# EAGLE design totalizer2020 (EAGLE 9.5.2)
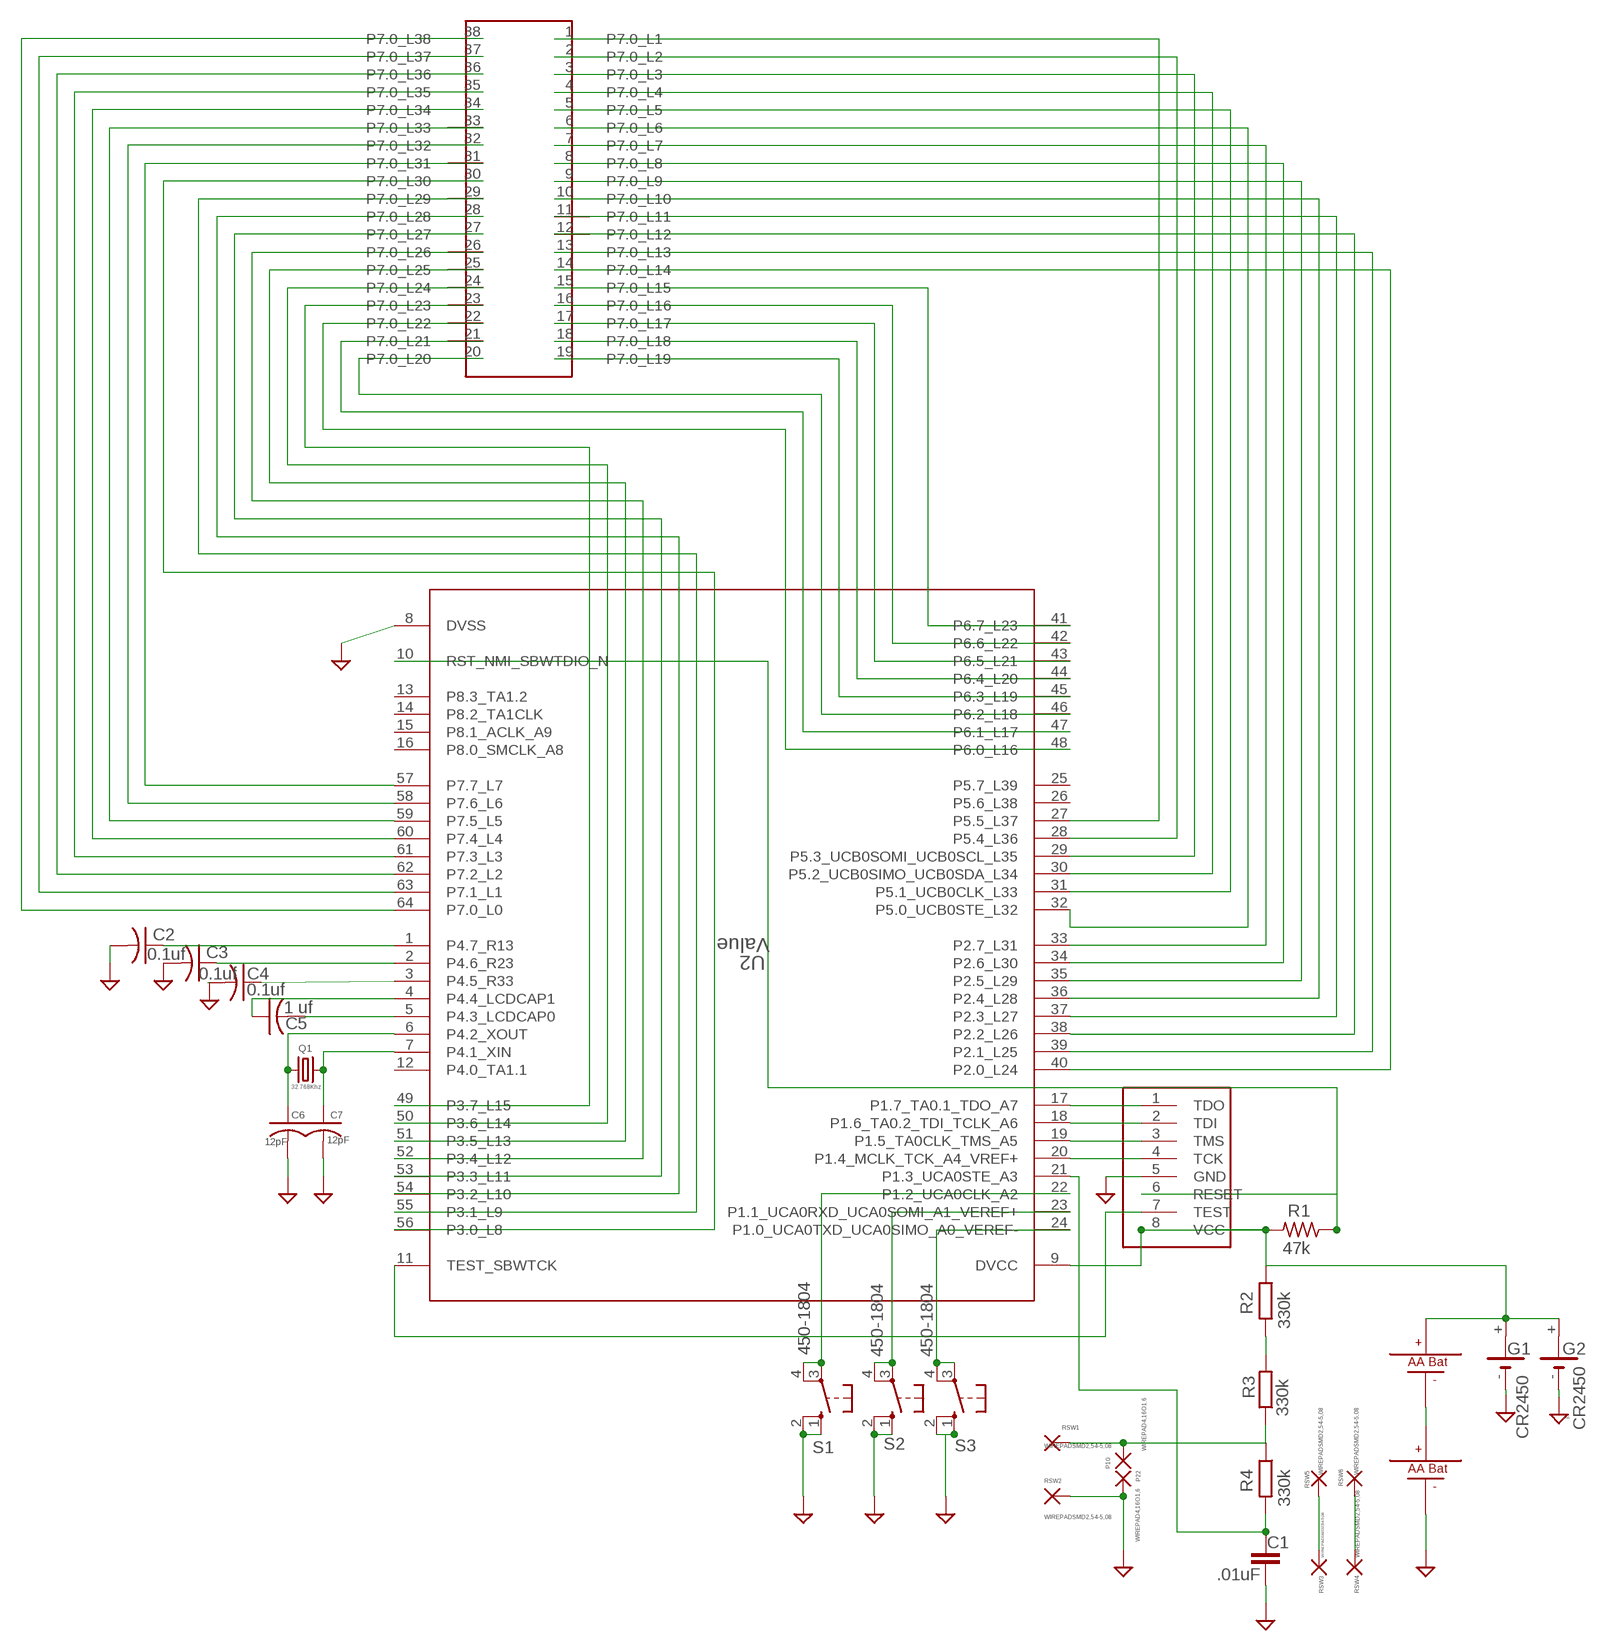
[diagram p0: schematic, sheet 1]

## Parts
8PINCONNECTOR  JST-8JST-8  [HDRVR8W64P150_1X8_1200X350X500B]
C1  .01uF  C-EUC0805  [C0805]
C2  0.1uf  C-USC0805  [C0805]
C3  0.1uf  C-USC0805  [C0805]
C4  0.1uf  C-USC0805  [C0805]
C5  1 uf  C-USC0805  [C0805]
C6  12pF  C-USC0805  [C0805]
C7  12pF  C-USC0805  [C0805]
G1  CR2450  CR2430H  [CR2430H]
G2  CR2450  CR2430H  [CR2430H]
P10  WIREPAD4,16O1,6  [4,16O1,6]
P22  WIREPAD4,16O1,6  [4,16O1,6]
Q1  32.768Khz  KX-327-NHT  [3.2X1.5]
R1  47k  R-US_R0805  [R0805]
R2  330k  R-R0805  [R0805]
R3  330k  R-R0805  [R0805]
R4  330k  R-R0805  [R0805]
RSW1  WIREPADSMD2,54-5,08  [SMD2,54-5,08]
RSW2  WIREPADSMD2,54-5,08  [SMD2,54-5,08]
RSW3  WIREPADSMD2,54-5,08  [SMD2,54-5,08]
RSW4  WIREPADSMD2,54-5,08  [SMD2,54-5,08]
RSW5  WIREPADSMD2,54-5,08  [SMD2,54-5,08]
RSW6  WIREPADSMD2,54-5,08  [SMD2,54-5,08]
S1  450-1804  10-XX  [B3F-10XX]
S2  450-1804  10-XX  [B3F-10XX]
S3  450-1804  10-XX  [B3F-10XX]
U2  Value  MSP430FR4133IPMR  [PM0064A_N]
U$1  LCD-38LCD-38  [DIP7140W53P200L5505H450Q38B]
U$2  AA_BATTERY  [AA_BATTERY]
U$3  AA_BATTERY  [AA_BATTERY]

## Nets
GND: 8PINCONNECTOR.5(GND) C1.1 C2.2 C3.2 C4.2 C6.2 C7.2 G1.- G2.- P22.1(P) RSW2.1(P) S1.1(S) S1.2(S1) S2.1(S) S2.2(S1) S3.1(S) S3.2(S1) U2.8(DVSS) U$3.3(BAT_-) U$3.4(BAT_-)
N$1: 8PINCONNECTOR.1(TDO) U2.17(P1.7_TA0.1_TDO_A7)
N$2: 8PINCONNECTOR.2(TDI) U2.18(P1.6_TA0.2_TDI_TCLK_A6)
N$3: 8PINCONNECTOR.3(TMS) U2.19(P1.5_TA0CLK_TMS_A5)
N$4: 8PINCONNECTOR.4(TCK) U2.20(P1.4_MCLK_TCK_A4_VREF+)
N$5: C6.1 Q1.1 U2.6(P4.2_XOUT)
N$6: 8PINCONNECTOR.6(RESET) R1.1 U2.10(RST_NMI_SBWTDIO_N)
N$7: 8PINCONNECTOR.7(TEST) U2.11(TEST_SBWTCK)
N$8: RSW3.1(P) RSW5.1(P)
N$9: S2.3(P) S2.4(P1) U2.23(P1.1_UCA0RXD_UCA0SOMI_A1_VEREF+)
N$10: S1.3(P) S1.4(P1) U2.22(P1.2_UCA0CLK_A2)
N$11: C5.1 U2.4(P4.4_LCDCAP1)
N$12: S3.3(P) S3.4(P1) U2.24(P1.0_UCA0TXD_UCA0SIMO_A0_VEREF-)
N$13: C5.2 U2.5(P4.3_LCDCAP0)
N$14: C4.1 U2.3(P4.5_R33)
N$15: C3.1 U2.2(P4.6_R23)
N$16: C2.1 U2.1(P4.7_R13)
N$17: 8PINCONNECTOR.8(VCC) G1.+ G2.+ R1.2 R2.1 U2.9(DVCC) U$2.2(BAT_+) U$2.P1(BAT_+)
N$18: C1.2 R4.2 U2.21(P1.3_UCA0STE_A3)
N$19: C7.1 Q1.2 U2.7(P4.1_XIN)
N$20: U2.64(P7.0_L0) U$1.38(P7.0_L38)
N$21: U2.63(P7.1_L1) U$1.37(P7.0_L37)
N$22: U2.62(P7.2_L2) U$1.36(P7.0_L36)
N$23: U2.61(P7.3_L3) U$1.35(P7.0_L35)
N$24: U2.60(P7.4_L4) U$1.34(P7.0_L34)
N$25: U2.59(P7.5_L5) U$1.33(P7.0_L33)
N$26: U2.58(P7.6_L6) U$1.32(P7.0_L32)
N$27: U2.57(P7.7_L7) U$1.31(P7.0_L31)
N$28: U2.56(P3.0_L8) U$1.30(P7.0_L30)
N$29: U2.55(P3.1_L9) U$1.29(P7.0_L29)
N$30: U2.54(P3.2_L10) U$1.28(P7.0_L28)
N$31: U2.53(P3.3_L11) U$1.27(P7.0_L27)
N$32: U2.52(P3.4_L12) U$1.26(P7.0_L26)
N$33: U2.51(P3.5_L13) U$1.25(P7.0_L25)
N$34: U2.50(P3.6_L14) U$1.24(P7.0_L24)
N$35: U2.49(P3.7_L15) U$1.23(P7.0_L23)
N$36: U2.48(P6.0_L16) U$1.22(P7.0_L22)
N$37: U2.47(P6.1_L17) U$1.21(P7.0_L21)
N$38: U2.46(P6.2_L18) U$1.20(P7.0_L20)
N$39: U2.45(P6.3_L19) U$1.19(P7.0_L19)
N$40: U2.44(P6.4_L20) U$1.18(P7.0_L18)
N$41: U$2.3(BAT_-) U$2.4(BAT_-) U$3.2(BAT_+) U$3.P1(BAT_+)
N$42: U2.43(P6.5_L21) U$1.17(P7.0_L17)
N$43: U2.42(P6.6_L22) U$1.16(P7.0_L16)
N$44: U2.41(P6.7_L23) U$1.15(P7.0_L15)
N$45: U2.40(P2.0_L24) U$1.14(P7.0_L14)
N$46: U2.39(P2.1_L25) U$1.13(P7.0_L13)
N$47: U2.38(P2.2_L26) U$1.12(P7.0_L12)
N$48: U2.37(P2.3_L27) U$1.11(P7.0_L11)
N$49: U2.36(P2.4_L28) U$1.10(P7.0_L10)
N$50: U2.35(P2.5_L29) U$1.9(P7.0_L9)
N$51: U2.34(P2.6_L30) U$1.8(P7.0_L8)
N$52: U2.33(P2.7_L31) U$1.7(P7.0_L7)
N$53: U2.32(P5.0_UCB0STE_L32) U$1.6(P7.0_L6)
N$54: U2.31(P5.1_UCB0CLK_L33) U$1.5(P7.0_L5)
N$55: U2.30(P5.2_UCB0SIMO_UCB0SDA_L34) U$1.4(P7.0_L4)
N$56: U2.29(P5.3_UCB0SOMI_UCB0SCL_L35) U$1.3(P7.0_L3)
N$57: U2.28(P5.4_L36) U$1.2(P7.0_L2)
N$58: U2.27(P5.5_L37) U$1.1(P7.0_L1)
N$59: RSW4.1(P) RSW6.1(P)
N$69: R2.2 R3.2
N$70: P10.1(P) R3.1 R4.1 RSW1.1(P)
Unconnected: G1.+@1(+) G2.+@1(+) U2.12(P4.0_TA1.1) U2.13(P8.3_TA1.2) U2.14(P8.2_TA1CLK) U2.15(P8.1_ACLK_A9) U2.16(P8.0_SMCLK_A8) U2.25(P5.7_L39) U2.26(P5.6_L38)

## Library data of the parts
8PINCONNECTOR = JST-8:JST-8
C1 = rcl:C-EU: CAPACITOR, European symbol; SPICEPREFIX: C
C2-C5 = rcl:C-US: CAPACITOR, American symbol; SPICEPREFIX: C
C6 C7 = resistor:C-US: CAPACITOR, American symbol
G1 G2 = battery:CR2430H: LI BATTERY Varta
P10 P22 RSW1-RSW6 = wirepad:WIREPAD: Wire PAD connect wire on PCB
Q1 = crystal-geyer_V1_0:KX-327: Tuning Fork Crystals (kHz) SMD: KX327 - Serie Model Size l/w/h [mm] Frequency Range Frequency Stability Temp. Range [°C] Load Capacitance AECQ 200 availabel Datasheet KX-327VT KX-327FT KX-327RT KX-327NHT KX-327NHF KX-327L KX-327S 1.25/1.05/0.5 1.6/1.0/0.5 2.0/1.2/0.6 3.2/1.5/0.8 3.2/1.5/0.8 7.0/1.5/1.4 8.2/3.8/2.5 32,768 kHz 32,768 kHz 32,768 kHz 32,768 kHz 32,768 kHz 32,768 kHz 32,768 kHz ±10 … ±20ppm ±10 … ±20ppm ±10 … ±20ppm ±10 … ±20ppm ±10 … ±20ppm ±10 … ±20ppm ±5 … ±20ppm (*) -40°C …+85°C (*) -40°C …+85°C (*) -40°C …+85°C (*) -40°C …+85°C (*) -40°C …+125°C (*) -40°C …+85°C (*) -40°C …+85°C 7/9/12,5 7/9/12,5 7/9/12,6 7/9/12,5 9/12,5 7/9/12,5 6/12,5 - - - - yes - - KX-327VT.pdf <http://www.geyer-electronic.de/uploads/tx_userartikelfrequenz/GEYER-KX-327VT.pdf> KX-327FT.pdf <http://www.geyer-electronic.de/uploads/tx_userartikelfrequenz/GEYER-KX-327FT.pdf> KX-327RT.pdf <http://www.geyer-electronic.de/uploads/tx_userartikelfrequenz/GEYER-KX-327RT.pdf> KX-327NHT.pdf <http://www.geyer-electronic.de/uploads/tx_userartikelfrequenz/GEYER-KX-327NHT.pdf> KX-327NHF.pdf <http://www.geyer-electronic.de/uploads/tx_userartikelfrequenz/GEYER-KX-327NHF.pdf> KX-327L.pdf <http://www.geyer-electronic.de/uploads/tx_userartikelfrequenz/GEYER-KX-327L.pdf> KX-327S.pdf <http://www.geyer-electronic.de/uploads/tx_userartikelfrequenz/GEYER-KX-327S.pdf> <http://www.geyer-electronic.de/fileadmin/template/img/logo-geyer-electronic.png> Details see: http://www.geyer-electronic.de/Frequenz-Produkte.9.0.html Created 2016-06-07, Hans Locher 2016 (C) Geyer Quartz Technology KX327VT,KX327FT,KX327RT,KX327NHT,KX327NHF,KX327S,KX327L;125105;1610;2012;3215;7015;8238;1,25x1,05,1.25x1.05;1,6x1,0,1.6x1.0;2,0x1,2,2.0x1.2;3,2x1,5,3.2x1.5;8,2x3,8,8.2x3.8,7.0x1.5,7,0x1,532.768kHz
R1 = resistor:R-US_: RESISTOR, American symbol
R2-R4 = quantum-sensor:R: Resistor
S1-S3 = switch-omron:10-XX: OMRON SWITCH; MPN: B3F-1000; OC_FARNELL: 176432; OC_NEWARK: 36M3542
U2 = msp430fr4133-64:MSP430FR4133IPMR; ALTERNATEPARTNUMBER: MSP430FR4133IPM; APPLICATION_BUILDNUMBER: *; COMPTYPE: IC; MANUFACTURER: Texas Instruments; MOUNTTYPE: SMT; PACKAGEREFERENCE: PM0064A; PARTNUMBER: MSP430FR4133IPMR; PIN_COUNT: 64; REFDES: RefDes; ROHS: Y; TYPE: TYPE
U$1 = LCD-38:LCD-38
U$2 U$3 = AA_Battery:AA_BATTERY

## Board
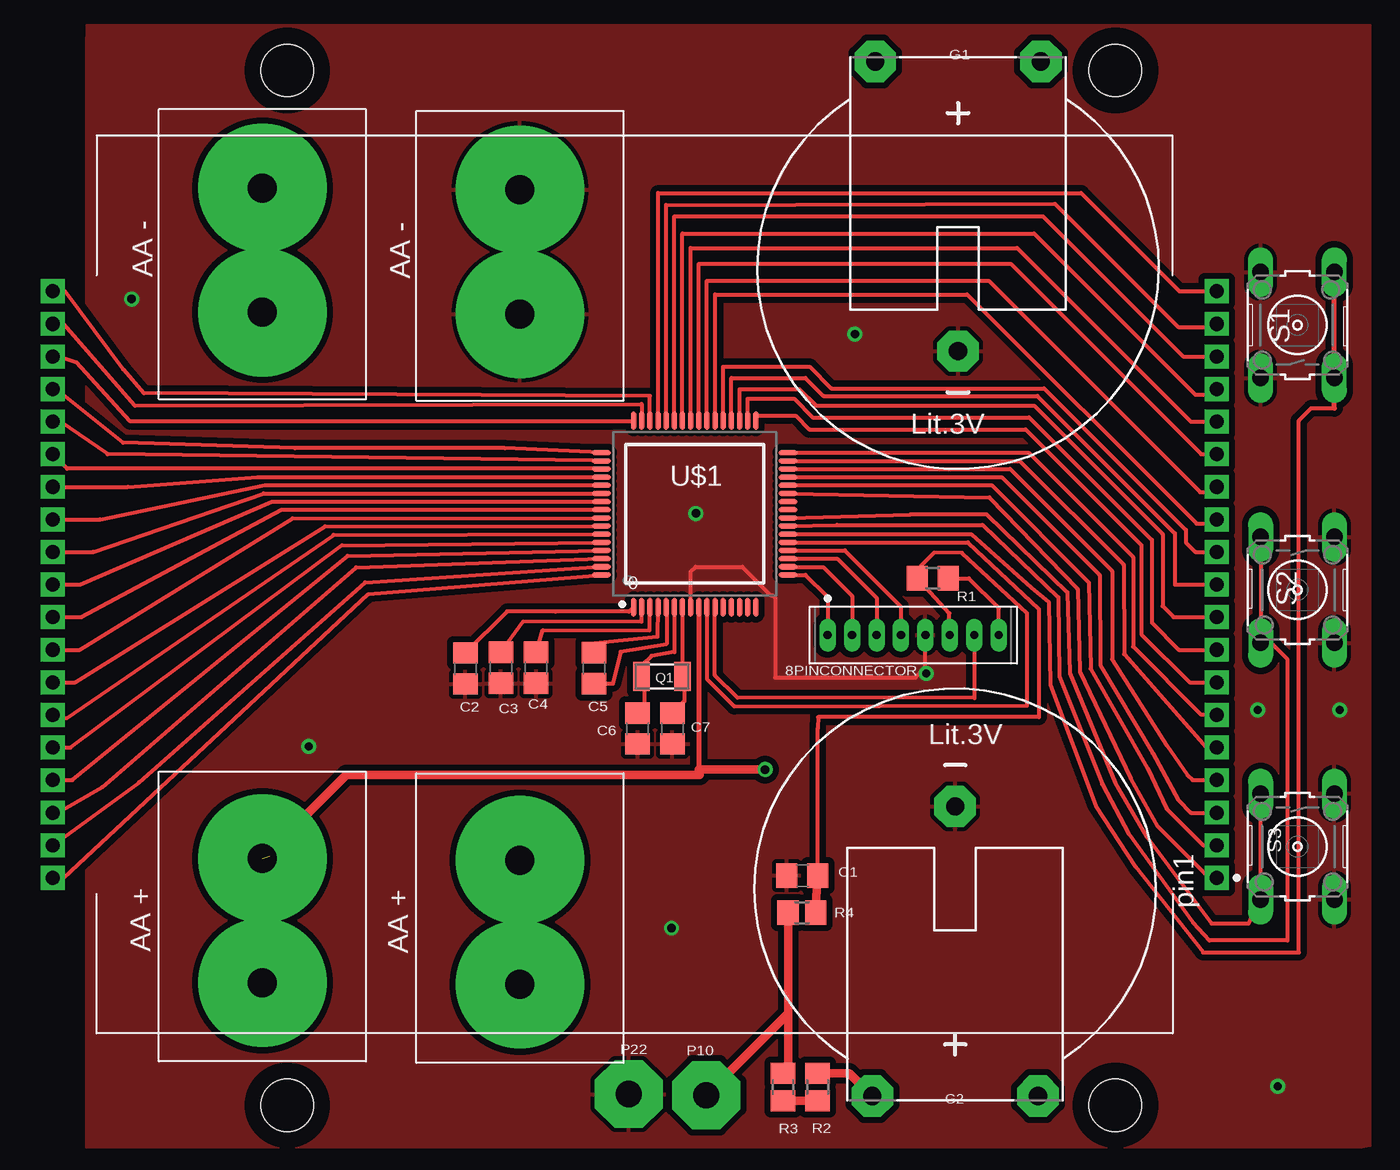
[diagram p1: board, top side]
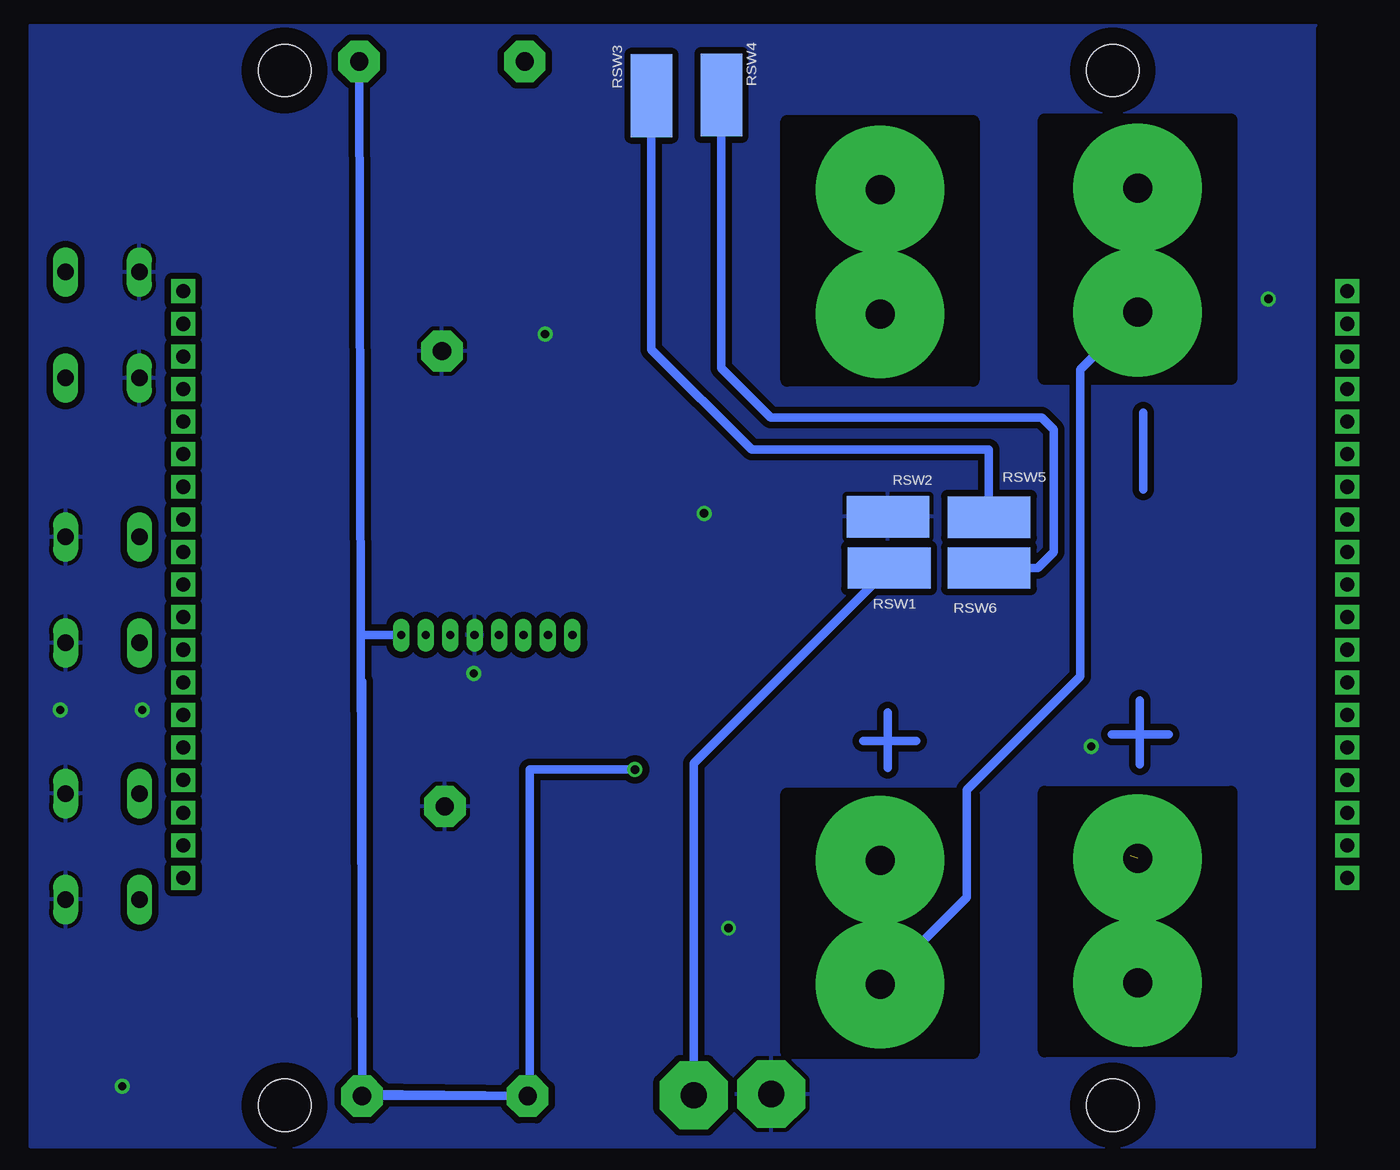
[diagram p2: board, bottom side, seen from below]

No outline drawn. Coordinates in mm, seen from the top.
Copper layers (1*16): Top 0.035mm / dielectric 1.5mm / Bottom 0.035mm
Design rules "default": minimum track width 10mil, minimum drill 20mil, track to track 8mil, track to pad 8mil, pad to pad 8mil, via to via 8mil, smd to smd 8mil, copper to edge 40mil, drill to drill 8mil, minimum pad ring 10mil, minimum via ring 8mil, stop-mask expansion 4mil, vias tented up to drill 0mil, thermal gap 10mil
Holes 3.2 mm at 16.76,3.05 16.76,66.55 67.56,66.55 67.56,3.05

### Footprints (pad centres in the part's own frame; a part is rotated, then mirrored left to right if it is on the bottom)
HDRVR8W64P150_1X8_1200X350X500B = drill 0.508 pad 1.016 long: 1 0,0; 2 1.5,0; 3 3,0; 4 4.5,0; 5 6,0; 6 7.5,0; 7 9,0; 8 10.5,0
C0805 = smd 1.3 x 1.5: 1 -0.95,0; 2 0.95,0
CR2430H = drill 1.118 pad 2.54 octagon: + 5.08,12.7; +@1 -5.08,12.7; - 0,-5.08
4,16O1,6 = drill 1.6 pad 4.166 octagon: 1 0,0
3.2X1.5 = smd 1 x 1.8: 1 -1.25,0; 2 1.25,0
R0805 = smd 1.3 x 1.5: 1 -0.95,0; 2 0.95,0
R0805' = smd 1.3 x 1.5: 1 -0.85,0; 2 0.85,0
SMD2,54-5,08 = smd 2.54 x 5.08: 1 0,0
B3F-10XX = drill 1.016 long: 1 -3.251,2.261; 2 3.251,2.261; 3 -3.251,-2.261; 4 3.251,-2.261
PM0064A_N = smd 1.15 x 0.3: 1 -5.725,3.75; 2 -5.725,3.25; 3 -5.725,2.75; 4 -5.725,2.25; 5 -5.725,1.75; 6 -5.725,1.25; 7 -5.725,0.75; 8 -5.725,0.25; 9 -5.725,-0.25; 10 -5.725,-0.75; 11 -5.725,-1.25; 12 -5.725,-1.75; 13 -5.725,-2.25; 14 -5.725,-2.75; 15 -5.725,-3.25; 16 -5.725,-3.75; 33 5.725,-3.75; 34 5.725,-3.25; 35 5.725,-2.75; 36 5.725,-2.25; 37 5.725,-1.75; 38 5.725,-1.25; 39 5.725,-0.75; 40 5.725,-0.25; 41 5.725,0.25; 42 5.725,0.75; 43 5.725,1.25; 44 5.725,1.75; 45 5.725,2.25; 46 5.725,2.75; 47 5.725,3.25; 48 5.725,3.75 | smd 0.3 x 1.15: 17 -3.75,-5.725; 18 -3.25,-5.725; 19 -2.75,-5.725; 20 -2.25,-5.725; 21 -1.75,-5.725; 22 -1.25,-5.725; 23 -0.75,-5.725; 24 -0.25,-5.725; 25 0.25,-5.725; 26 0.75,-5.725; 27 1.25,-5.725; 28 1.75,-5.725; 29 2.25,-5.725; 30 2.75,-5.725; 31 3.25,-5.725; 32 3.75,-5.725; 49 3.75,5.725; 50 3.25,5.725; 51 2.75,5.725; 52 2.25,5.725; 53 1.75,5.725; 54 1.25,5.725; 55 0.75,5.725; 56 0.25,5.725; 57 -0.25,5.725; 58 -0.75,5.725; 59 -1.25,5.725; 60 -1.75,5.725; 61 -2.25,5.725; 62 -2.75,5.725; 63 -3.25,5.725; 64 -3.75,5.725
DIP7140W53P200L5505H450Q38B = drill 0.864 pad 1.464 square: 1 -35.7,18; 2 -35.7,16; 3 -35.7,14; 4 -35.7,12; 5 -35.7,10; 6 -35.7,8; 7 -35.7,6; 8 -35.7,4; 9 -35.7,2; 10 -35.7,0; 11 -35.7,-2; 12 -35.7,-4; 13 -35.7,-6; 14 -35.7,-8; 15 -35.7,-10; 16 -35.7,-12; 17 -35.7,-14; 18 -35.7,-16; 19 -35.7,-18; 20 35.7,-18; 21 35.7,-16; 22 35.7,-14; 23 35.7,-12; 24 35.7,-10; 25 35.7,-8; 26 35.7,-6; 27 35.7,-4; 28 35.7,-2; 29 35.7,0; 30 35.7,2; 31 35.7,4; 32 35.7,6; 33 35.7,8; 34 35.7,10; 35 35.7,12; 36 35.7,14; 37 35.7,16; 38 35.7,18
AA_BATTERY = drill 1.778 pad 7.874: 2 -16.764,0; 3 16.764,0; 4 24.384,0; P1 -24.384,0

### Placement (x,y rotation side)
8PINCONNECTOR  49.91,31.9 0 top
C1  48.36,17.14 0 top
C2  27.69,29.84 270 top
C3  29.87,29.9 270 top
C4  32.03,29.9 270 top
C5  35.59,29.87 270 top
C6  38.25,26.16 270 top
C7  40.39,26.16 270 top
G1  57.91,54.41 0 top
G2  57.73,16.31 180 top
P10  42.47,3.66 0 top
P22  37.72,3.73 0 top
Q1  39.75,29.36 0 top
R1  56.36,35.38 0 top
R2  330k  [R0805']  49.3,4.17 270 top
R3  330k  [R0805']  47.17,4.17 270 top
R4  330k  [R0805']  48.34,14.86 0 top
RSW1  30.48,36.02 270 bottom
RSW2  30.56,39.17 270 bottom
RSW3  45.06,65 0 bottom
RSW4  40.77,65.05 0 bottom
RSW5  24.36,39.14 270 bottom
RSW6  24.36,36.02 90 bottom
S1  78.74,50.93 90 top
S2  78.74,34.67 270 top
S3  78.74,18.92 270 top
U2  41.76,39.34 90 top
U$1  38.07,35 180 top
U$2  15.24,34.95 90 top
U$3  31.04,34.85 90 top

### Tracks (layer width: path | path; a pad name or v marks a point on that pad's centre or on a via)
GND  (via drill 0.51)
  Top 0.254: U2.8 41.51,35.79 41.81,36.09 44.68,36.09 46.43,34.34 46.53,34.34 46.69,34.19 46.69,29.29 55.3,29.29 55.91,29.9 8PINCONNECTOR.5
  Bottom 0.254: 31.19,39.8 RSW2.1
  other vias: 41.83,39.37 51.59,50.37 77.52,4.22 40.34,13.92 7.21,52.53 18.08,25.07 55.96,29.54 76.3,27.3 81.33,27.3
  pour Bottom (isolate 0.406): 4.37,69.24 4.37,0.48 83.13,0.48 83.19,0.5 83.19,69.32 83.16,69.34 5.23,69.34 4.29,69.32 4.32,69.27
  pour Top (isolate 0.381): 4.48,69.33 83.19,69.33 83.19,0.55 82.66,0.46 4.45,0.46 4.45,67.89
N$1
  Top 0.254: U2.17 48.55,35.59 49.91,34.23 8PINCONNECTOR.1
N$2
  Top 0.254: U2.18 47.5,36.08 49.63,36.08 51.41,34.29 8PINCONNECTOR.2
N$3
  Top 0.254: U2.19 50.5,36.59 52.91,34.19 8PINCONNECTOR.3
N$4
  Top 0.254: U2.20 50.97,37.09 54.41,33.65 8PINCONNECTOR.4
N$5
  Top 0.254: C6.1 38.66,27.52 38.66,29.2 Q1.1 38.5,30.02 39.11,30.63 40.51,30.86 U2.6
N$6
  Top 0.254: U2.10 42.51,29.22 44.2,27.53 62.13,27.57 62.13,33.25 58.14,36.94 56.44,36.96 55.41,35.93 R1.1 55.59,35.2 57.39,33.24 8PINCONNECTOR.6
N$7
  Top 0.254: 8PINCONNECTOR.7 58.91,28.04 44.38,28.07 43,29.44 U2.11
N$8
  Bottom 0.508: RSW5.1 24.36,43.28 38.91,43.28 45.06,49.43 RSW3.1
N$9
  Top 0.254: U2.23 50.48,38.66 59.36,38.65 59.44,38.66 64.06,34.22 64.14,29.36 66.75,22.76 68.4,19.68 72.33,14.26 73.33,13.16 78.13,13.16 78.13,30.4 77.11,31.42 S2.4 76.52,31.46 76.48,31.87 S2.3
N$10
  Top 0.254: 81,45.82 79.58,45.82 78.82,45.06 78.82,12.42 72.95,12.42 68.79,17.7 66.36,21.43 63.58,28.84 63.48,33.93 62.4,34.83 58.72,38.09 U2.22
  Top 0.305: 81,45.82 S1.3 S1.4
N$11
  Top 0.254: C5.1 35.59,31.38 39.47,31.79 39.48,33.59 U2.4
N$12
  Top 0.254: S3.3 S3.4 75.74,14.2 73.46,14.2 69.5,19.51 67.56,22.84 64.77,29.57 64.62,34.52 59.66,39.31 55,39.31 U2.24
N$13
  Top 0.254: C5.2 36.74,28.92 37.22,30.89 40.03,31.36 40.03,33.59 U2.5
N$14
  Top 0.254: C4.1 32.45,32.21 38.99,32.2 38.99,33.6 U2.3
N$15
  Top 0.254: C3.1 31.23,32.72 38.51,32.72 U2.2
N$16
  Top 0.254: C2.1 30.25,33.35 33.19,33.36 33.21,33.34 37.73,33.34 U2.1
N$17  (via drill 0.51)  (1 unrouted)
  Top 0.254: R1.2 58.58,35.38 60.41,33.55 8PINCONNECTOR.8
  Top 0.305: U2.9 42.01,23.65 42.01,23.37
  Top 0.508: 15.7,17.55 15.7,18.36 | G2.+ 51.24,5.02 R2.1 | 42.01,23.37 42.06,23.32 20.37,23.32 U$2.2 | v46.08,23.65 42.01,23.65
  Bottom 0.254: 52.68,3.63 G2.+
  Bottom 0.305: G2.+ 52.53,3.73 | 62.84,31.9 62.89,31.85
  Bottom 0.508: 62.81,29.06 62.81,3.63 52.68,3.63 62.81,3.76 62.89,31.85 G1.+ | 52.53,3.73 52.53,23.65 v46.08,23.65 | 8PINCONNECTOR.8 62.84,31.9 | U$2.2 U$2.P1 | U$2.P1 15.24,10.21 15.39,10.06 15.39,10.41 U$2.P1
  other vias: 15.24,10.57
N$18
  Top 0.254: U2.21 58.52,37.59 62.87,33.5 62.87,26.87 49.33,26.86 49.31,26.2 C1.2 | 49.19,15.37 R4.2
  Top 0.508: C1.2 49.19,15.37
N$19
  Top 0.254: U2.7 Q1.2 41.12,29.24 41.12,27.85 C7.1
N$20
  Top 0.254: U$1.38 3.06,17 21.74,34.41 U2.64
N$21
  Top 0.254: U$1.37 7.67,22.86 21.54,35.13 U2.63
N$22
  Top 0.254: U$1.36 3.03,21.18 5.41,22.55 20.99,36.06 U2.62
N$23
  Top 0.254: U$1.35 3.59,23 20.47,36.76 U2.61
N$24
  Top 0.254: U$1.34 3.48,25 20.11,37.41 U2.60
N$25
  Top 0.254: U$1.33 2.58,26.8 3.2,26.8 19.61,38.05 U2.59
N$26
  Top 0.254: U$1.32 3.76,29 19.09,38.57 U2.58
N$27
  Top 0.254: U$1.31 4.04,31 17.09,39.07 U2.57
N$28
  Top 0.254: U$1.30 4.14,33 16.41,39.59 U2.56
N$29
  Top 0.254: U$1.29 4.06,35 15.84,40.09 U2.55
N$30
  Top 0.254: U$1.28 4.85,37 15.31,40.59 U2.54
N$31
  Top 0.254: U$1.27 5.28,39 15.39,41.09 U2.53
N$32
  Top 0.254: U$1.26 6.98,41 14.95,41.59 U2.52
N$33
  Top 0.254: U2.51 36.02,42.11 3.26,42.11 U$1.25
N$34
  Top 0.254: U2.50 35.52,42.59 35.52,42.6 5.75,43.01 2.84,45 U$1.24
N$35
  Top 0.254: U2.49 30.11,43.37 17.25,43.37 6.68,43.7 2.57,47 U$1.23
N$36
  Top 0.254: U$1.22 2.8,49 3.83,48.64 7.13,45.02 37.96,45.02 U2.48
N$37
  Top 0.254: U$1.21 3.05,51 7.41,45.98 38.5,46.08 U2.47
N$38
  Top 0.254: U$1.20 3.15,53 6.7,48.21 7.97,46.75 39.01,46.57 U2.46
N$39
  Top 0.254: U2.45 39.51,59.03 65.46,59.03 71.49,53 U$1.19
N$40
  Top 0.254: U2.44 40.01,58.3 63.83,58.38 71.46,50.77 73.55,50.77 U$1.18
N$41
  Bottom 0.508: U$2.3 18.75,48.21 18.75,29.36 25.7,22.4 25.7,15.8 U$3.P1 U$3.2 | U$2.4 U$2.3 | U$2.3 15.49,51.46
N$42
  Top 0.254: U2.43 40.51,57.61 63.12,57.61 71.72,49 U$1.17
N$43
  Top 0.254: U2.42 41.01,56.54 62.59,56.54 72.47,46.66 73.43,46.66 U$1.16
N$44
  Top 0.254: U2.41 41.51,55.65 61.54,55.65 72.19,45 U$1.15
N$45
  Top 0.254: U2.40 42.01,54.69 61.14,54.69 72.82,43 U$1.14
N$46
  Top 0.254: U2.39 42.51,53.65 59.79,53.65 72.77,40.66 73.44,40.66 U$1.13
N$47
  Top 0.254: U2.38 43.01,52.81 58.47,52.81 72.54,38.73 73.51,38.73 U$1.12
N$48
  Top 0.254: U2.37 43.51,48.37 48.81,48.37 50.14,47.04 63.2,47.04 71.88,38.35 71.88,37.59 72.47,37 U$1.11
N$49
  Top 0.254: U2.36 44.01,47.68 48.55,47.68 49.65,46.58 62.78,46.58 71.22,38.14 71.22,35 U$1.10
N$50
  Top 0.254: U2.35 44.51,46.99 48.18,46.99 49.2,45.97 62.59,45.97 70.46,38.1 70.46,33.68 71.14,33 U$1.9
N$51
  Top 0.254: U2.34 45.01,46.41 47.85,46.41 49,45.26 62.28,45.26 69.8,37.74 69.8,32.66 71.46,31 U$1.8
N$52
  Top 0.254: U2.33 45.51,45.36 47.95,45.36 48.79,44.53 62.05,44.53 69.16,37.41 69.16,31.95 72.12,29 U$1.7
N$53
  Top 0.254: U2.32 62.24,43.09 68.66,36.68 68.66,31.19 72.85,27 U$1.6
N$54
  Top 0.254: U$1.5 73.51,24.74 73.38,24.74 68.1,30.73 68.07,36.22 61.7,42.59 U2.31
N$55
  Top 0.254: U$1.4 72.3,23 71.98,23.32 70.71,25.13 67.36,30.41 67.37,35.83 61.11,42.09 U2.30
N$56
  Top 0.254: U2.29 60.59,41.59 66.6,35.59 66.65,30.07 69.85,24.66 71.42,21.78 72.2,21 U$1.3
N$57
  Top 0.254: U$1.2 72.96,19 70.71,21.25 69.55,23.72 66.04,29.84 65.94,35.13 59.97,41.09 U2.28
N$58
  Top 0.254: U$1.1 73.32,17 70.16,20.17 68.5,23.11 65.38,29.67 65.25,34.72 59.84,40.35 U2.27
N$59
  Bottom 0.508: RSW6.1 21.36,36.02 20.37,37.01 20.37,44.53 21.11,45.26 37.74,45.26 40.77,48.28 RSW4.1
N$60
  Bottom 0.508: 13.34,25.81 16.84,25.81
N$61
  Bottom 0.508: 14.88,45.54 14.88,40.84
N$62
  Bottom 0.508: 15.11,27.89 15.11,23.95
N$63
  Bottom 0.508: 28.83,25.4 32.05,25.4
N$64
  Bottom 0.508: 30.56,27.15 30.56,23.75
N$69
  Top 0.508: R3.2 R2.2
N$70
  Top 0.254: R4.1
  Top 0.508: R3.1 47.49,4.69 R4.1 | R4.1 47.49,8.68 P10.1
  Bottom 0.508: P10.1 42.47,24.03 RSW1.1

### Text on the board
tNames: 0